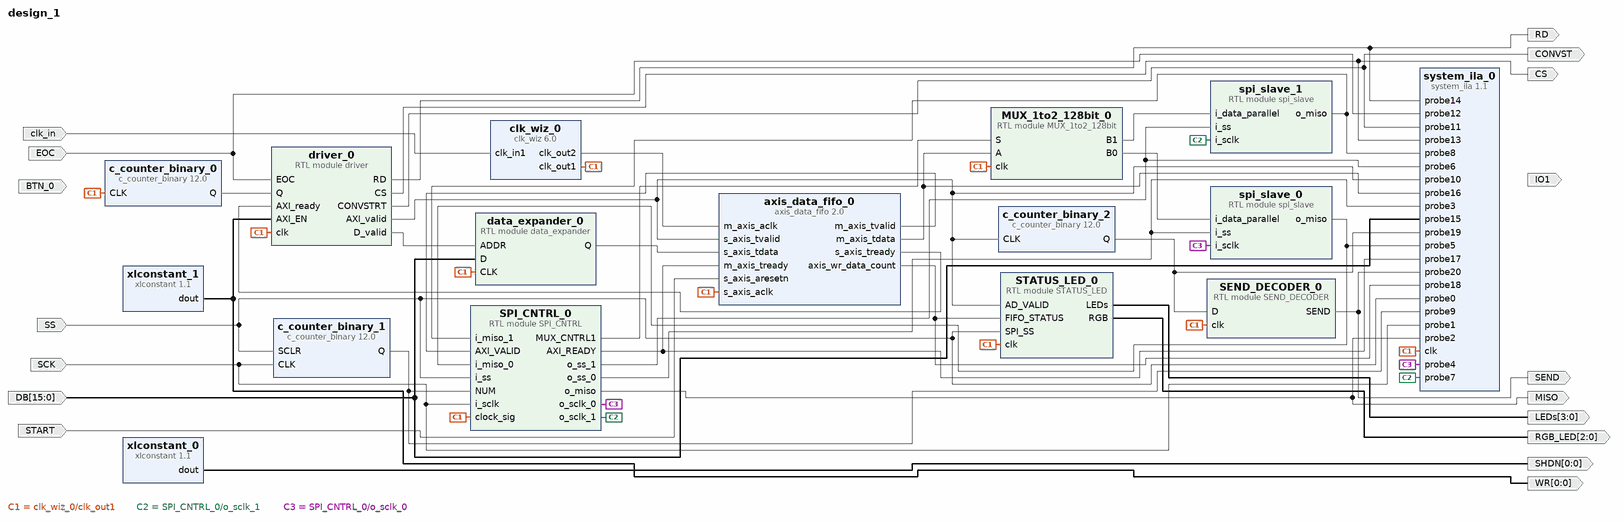
[diagram p0: block diagram of the top level]
# Vivado block design design_1, xc7s25csga225-1, Vivado 2020.2
create_bd_design design_1

create_bd_port -dir I EOC
create_bd_port -dir I -type clk clk_in
set_property -dict {CONFIG.FREQ_HZ 12000000} [get_bd_ports clk_in]
create_bd_port -dir O CONVST
create_bd_port -dir O CS
create_bd_port -dir O RD
create_bd_port -dir I -from 15 -to 0 DB
create_bd_port -dir O -from 0 -to 0 SHDN
create_bd_port -dir O -from 0 -to 0 WR
create_bd_port -dir I BTN_0
create_bd_port -dir I -type clk SCK
set_property -dict {CONFIG.FREQ_HZ 25000000} [get_bd_ports SCK]
create_bd_port -dir I SS
create_bd_port -dir O MISO
create_bd_port -dir O SEND
create_bd_port -dir O -from 3 -to 0 LEDs
create_bd_port -dir O -from 2 -to 0 RGB_LED
create_bd_port -dir I START
create_bd_port -dir O IO1

create_bd_cell -type ip -vlnv xilinx.com:ip:c_counter_binary:12.0 c_counter_binary_0
set_property -dict [list \
  CONFIG.CE false \
  CONFIG.Final_Count_Value 3E8 \
  CONFIG.Output_Width 11 \
  CONFIG.Restrict_Count true \
] [get_bd_cells c_counter_binary_0]
create_bd_cell -type ip -vlnv xilinx.com:ip:clk_wiz:6.0 clk_wiz_0
set_property -dict [list \
  CONFIG.CLKIN1_JITTER_PS 833.33 \
  CONFIG.CLKOUT1_JITTER 479.872 \
  CONFIG.CLKOUT1_PHASE_ERROR 668.310 \
  CONFIG.CLKOUT1_REQUESTED_OUT_FREQ 100 \
  CONFIG.CLKOUT2_JITTER 586.500 \
  CONFIG.CLKOUT2_PHASE_ERROR 668.310 \
  CONFIG.CLKOUT2_REQUESTED_OUT_FREQ 25 \
  CONFIG.CLKOUT2_USED true \
  CONFIG.CLK_IN1_BOARD_INTERFACE sys_clock \
  CONFIG.MMCM_CLKFBOUT_MULT_F 62.500 \
  CONFIG.MMCM_CLKIN1_PERIOD 83.333 \
  CONFIG.MMCM_CLKIN2_PERIOD 10.0 \
  CONFIG.MMCM_CLKOUT0_DIVIDE_F 7.500 \
  CONFIG.MMCM_CLKOUT1_DIVIDE 30 \
  CONFIG.NUM_OUT_CLKS 2 \
  CONFIG.USE_LOCKED false \
  CONFIG.USE_RESET false \
] [get_bd_cells clk_wiz_0]
create_bd_cell -type ip -vlnv xilinx.com:ip:xlconstant:1.1 xlconstant_0
set_property -dict {CONFIG.CONST_VAL 0} [get_bd_cells xlconstant_0]
create_bd_cell -type ip -vlnv xilinx.com:ip:xlconstant:1.1 xlconstant_1
set_property -dict {CONFIG.CONST_VAL 1} [get_bd_cells xlconstant_1]
create_bd_cell -type ip -vlnv xilinx.com:ip:axis_data_fifo:2.0 axis_data_fifo_0
set_property -dict [list \
  CONFIG.FIFO_DEPTH 8192 \
  CONFIG.HAS_WR_DATA_COUNT 1 \
  CONFIG.IS_ACLK_ASYNC 1 \
  CONFIG.TDATA_NUM_BYTES 16 \
] [get_bd_cells axis_data_fifo_0]
create_bd_cell -type ip -vlnv xilinx.com:ip:c_counter_binary:12.0 c_counter_binary_1
set_property -dict [list \
  CONFIG.Implementation Fabric \
  CONFIG.Output_Width 8 \
  CONFIG.Restrict_Count false \
  CONFIG.SCLR true \
] [get_bd_cells c_counter_binary_1]
create_bd_cell -type ip -vlnv xilinx.com:ip:c_counter_binary:12.0 c_counter_binary_2
set_property -dict [list \
  CONFIG.Final_Count_Value 7FF \
  CONFIG.Output_Width 12 \
  CONFIG.Restrict_Count true \
] [get_bd_cells c_counter_binary_2]
create_bd_cell -type ip -vlnv xilinx.com:ip:system_ila:1.1 system_ila_0
set_property -dict [list \
  CONFIG.ALL_PROBE_SAME_MU_CNT 1 \
  CONFIG.C_ADV_TRIGGER false \
  CONFIG.C_DATA_DEPTH 2048 \
  CONFIG.C_EN_STRG_QUAL 0 \
  CONFIG.C_MON_TYPE NATIVE \
  CONFIG.C_NUM_OF_PROBES 21 \
  CONFIG.C_PROBE0_MU_CNT 1 \
  CONFIG.C_PROBE10_MU_CNT 1 \
  CONFIG.C_PROBE11_MU_CNT 1 \
  CONFIG.C_PROBE11_WIDTH 1 \
  CONFIG.C_PROBE12_MU_CNT 1 \
  CONFIG.C_PROBE13_MU_CNT 1 \
  CONFIG.C_PROBE14_MU_CNT 1 \
  CONFIG.C_PROBE15_MU_CNT 1 \
  CONFIG.C_PROBE15_WIDTH 16 \
  CONFIG.C_PROBE16_MU_CNT 1 \
  CONFIG.C_PROBE16_WIDTH 128 \
  CONFIG.C_PROBE17_MU_CNT 1 \
  CONFIG.C_PROBE18_MU_CNT 1 \
  CONFIG.C_PROBE18_WIDTH 32 \
  CONFIG.C_PROBE19_MU_CNT 1 \
  CONFIG.C_PROBE19_WIDTH 12 \
  CONFIG.C_PROBE1_MU_CNT 1 \
  CONFIG.C_PROBE20_MU_CNT 1 \
  CONFIG.C_PROBE2_MU_CNT 1 \
  CONFIG.C_PROBE3_MU_CNT 1 \
  CONFIG.C_PROBE4_MU_CNT 1 \
  CONFIG.C_PROBE5_MU_CNT 1 \
  CONFIG.C_PROBE6_MU_CNT 1 \
  CONFIG.C_PROBE7_MU_CNT 1 \
  CONFIG.C_PROBE8_MU_CNT 1 \
  CONFIG.C_PROBE9_MU_CNT 1 \
  CONFIG.C_PROBE9_WIDTH 8 \
  CONFIG.C_PROBE_WIDTH_PROPAGATION MANUAL \
  CONFIG.C_TRIGIN_EN false \
  CONFIG.C_TRIGOUT_EN false \
] [get_bd_cells system_ila_0]
create_bd_cell -type module -reference spi_slave spi_slave_0
create_bd_cell -type module -reference spi_slave spi_slave_1
create_bd_cell -type module -reference data_expander data_expander_0
create_bd_cell -type module -reference STATUS_LED STATUS_LED_0
create_bd_cell -type module -reference SPI_CNTRL SPI_CNTRL_0
create_bd_cell -type module -reference driver driver_0
create_bd_cell -type module -reference SEND_DECODER SEND_DECODER_0
create_bd_cell -type module -reference MUX_1to2_128bit MUX_1to2_128bit_0

# ---- connections ----

connect_bd_net [get_bd_pins c_counter_binary_0/Q] [get_bd_pins driver_0/Q]
connect_bd_net [get_bd_pins driver_0/D_valid] [get_bd_pins data_expander_0/ADDR]
connect_bd_net [get_bd_pins clk_wiz_0/clk_out1] \
  [get_bd_pins c_counter_binary_0/CLK] [get_bd_pins axis_data_fifo_0/s_axis_aclk] [get_bd_pins system_ila_0/clk] \
  [get_bd_pins data_expander_0/CLK] [get_bd_pins STATUS_LED_0/clk] [get_bd_pins SPI_CNTRL_0/clock_sig] \
  [get_bd_pins driver_0/clk] [get_bd_pins SEND_DECODER_0/clk] [get_bd_pins MUX_1to2_128bit_0/clk]
connect_bd_net [get_bd_ports clk_in] [get_bd_pins clk_wiz_0/clk_in1]
connect_bd_net [get_bd_ports EOC] [get_bd_pins system_ila_0/probe12] [get_bd_pins driver_0/EOC]
connect_bd_net [get_bd_pins driver_0/RD] [get_bd_ports RD] [get_bd_pins system_ila_0/probe14]
connect_bd_net [get_bd_pins driver_0/CS] [get_bd_ports CS] [get_bd_pins system_ila_0/probe13]
connect_bd_net [get_bd_ports DB] [get_bd_pins system_ila_0/probe15] [get_bd_pins data_expander_0/D]
connect_bd_net [get_bd_pins driver_0/CONVSTRT] [get_bd_ports CONVST] [get_bd_pins system_ila_0/probe11]
connect_bd_net [get_bd_pins driver_0/AXI_valid] \
  [get_bd_pins axis_data_fifo_0/s_axis_tvalid] [get_bd_pins c_counter_binary_2/CLK] [get_bd_pins system_ila_0/probe10] \
  [get_bd_pins STATUS_LED_0/AD_VALID]
connect_bd_net [get_bd_pins clk_wiz_0/clk_out2] [get_bd_pins axis_data_fifo_0/m_axis_aclk]
connect_bd_net [get_bd_pins axis_data_fifo_0/s_axis_tready] [get_bd_pins driver_0/AXI_ready]
connect_bd_net [get_bd_pins axis_data_fifo_0/m_axis_tdata] [get_bd_pins system_ila_0/probe16] [get_bd_pins MUX_1to2_128bit_0/A]
connect_bd_net [get_bd_pins axis_data_fifo_0/m_axis_tvalid] [get_bd_pins SPI_CNTRL_0/AXI_VALID]
connect_bd_net [get_bd_pins xlconstant_0/dout] [get_bd_ports SHDN]
connect_bd_net [get_bd_pins xlconstant_1/dout] [get_bd_ports WR] [get_bd_pins driver_0/AXI_EN]
connect_bd_net [get_bd_pins SPI_CNTRL_0/MUX_CNTRL1] [get_bd_pins MUX_1to2_128bit_0/S]
connect_bd_net [get_bd_pins data_expander_0/Q] [get_bd_pins axis_data_fifo_0/s_axis_tdata]
connect_bd_net [get_bd_pins MUX_1to2_128bit_0/B1] [get_bd_pins spi_slave_1/i_data_parallel]
connect_bd_net [get_bd_pins SPI_CNTRL_0/o_sclk_1] [get_bd_pins system_ila_0/probe7] [get_bd_pins spi_slave_1/i_sclk]
connect_bd_net [get_bd_pins SPI_CNTRL_0/o_ss_0] [get_bd_pins system_ila_0/probe3] [get_bd_pins spi_slave_0/i_ss]
connect_bd_net [get_bd_pins SPI_CNTRL_0/o_ss_1] [get_bd_pins system_ila_0/probe6] [get_bd_pins spi_slave_1/i_ss]
connect_bd_net [get_bd_pins spi_slave_1/o_miso] [get_bd_pins system_ila_0/probe8] [get_bd_pins SPI_CNTRL_0/i_miso_1]
connect_bd_net [get_bd_pins spi_slave_0/o_miso] [get_bd_pins system_ila_0/probe5] [get_bd_pins SPI_CNTRL_0/i_miso_0]
connect_bd_net [get_bd_pins SPI_CNTRL_0/AXI_READY] [get_bd_pins axis_data_fifo_0/m_axis_tready] [get_bd_pins system_ila_0/probe17]
connect_bd_net [get_bd_pins c_counter_binary_1/Q] [get_bd_pins system_ila_0/probe9] [get_bd_pins SPI_CNTRL_0/NUM]
connect_bd_net [get_bd_ports SS] \
  [get_bd_pins c_counter_binary_1/SCLR] [get_bd_pins system_ila_0/probe0] [get_bd_pins STATUS_LED_0/SPI_SS] \
  [get_bd_pins SPI_CNTRL_0/i_ss]
connect_bd_net [get_bd_pins SPI_CNTRL_0/o_miso] [get_bd_ports MISO] [get_bd_pins system_ila_0/probe2]
connect_bd_net [get_bd_pins c_counter_binary_2/Q] [get_bd_pins system_ila_0/probe19] [get_bd_pins SEND_DECODER_0/D]
connect_bd_net [get_bd_pins SEND_DECODER_0/SEND] [get_bd_ports SEND] [get_bd_pins system_ila_0/probe20]
connect_bd_net [get_bd_pins STATUS_LED_0/LEDs] [get_bd_ports LEDs]
connect_bd_net [get_bd_pins STATUS_LED_0/RGB] [get_bd_ports RGB_LED]
connect_bd_net [get_bd_pins axis_data_fifo_0/axis_wr_data_count] [get_bd_pins system_ila_0/probe18] [get_bd_pins STATUS_LED_0/FIFO_STATUS]
connect_bd_net [get_bd_ports START] [get_bd_pins axis_data_fifo_0/s_axis_aresetn]
connect_bd_net [get_bd_pins MUX_1to2_128bit_0/B0] [get_bd_pins spi_slave_0/i_data_parallel]
connect_bd_net [get_bd_pins SPI_CNTRL_0/o_sclk_0] [get_bd_pins system_ila_0/probe4] [get_bd_pins spi_slave_0/i_sclk]
connect_bd_net [get_bd_ports SCK] [get_bd_pins system_ila_0/probe1] [get_bd_pins c_counter_binary_1/CLK] [get_bd_pins SPI_CNTRL_0/i_sclk]

validate_bd_design
save_bd_design
